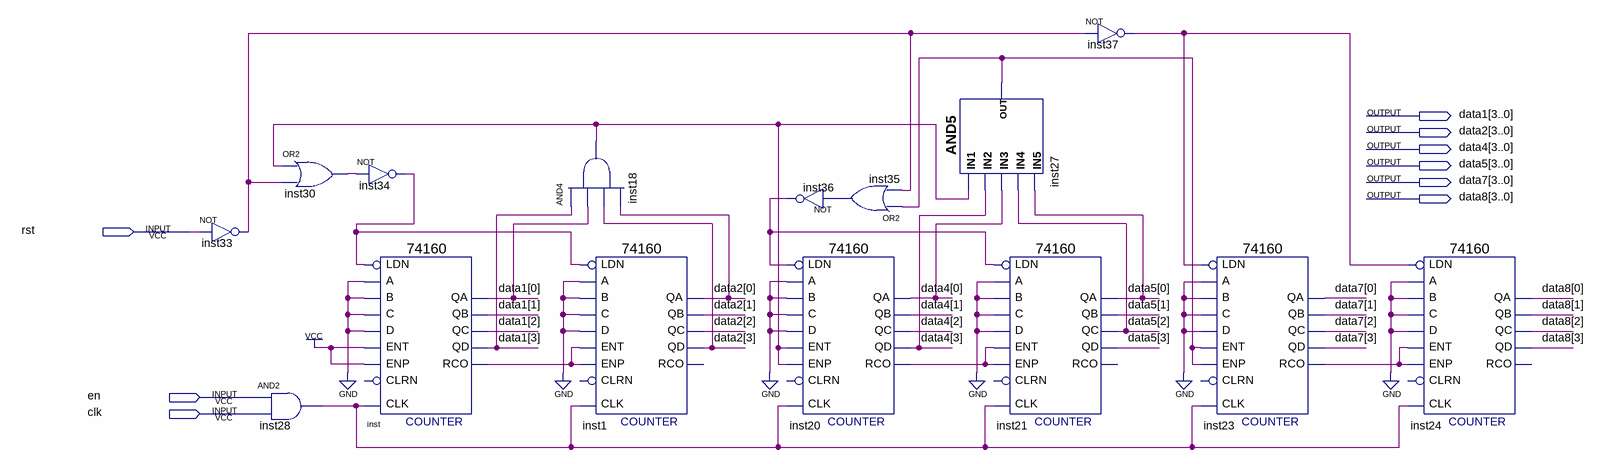
[diagram p0: schematic sheet]
// Quartus schematic timer.bdf as structural Verilog: 15 symbols, 9 pins
module timer (
  input  rst,
  input  en,
  input  clk,
  output [3:0] data1,
  output [3:0] data2,
  output [3:0] data4,
  output [3:0] data5,
  output [3:0] data7,
  output [3:0] data8
);

  wire inst18_out, inst20_rco, inst23_rco, inst27_out, inst28_out, inst30_out, inst33_out, inst34_out,
       inst35_out, inst36_out, inst37_out, inst_rco;

  not inst33 (inst33_out, rst);
  or inst30 (inst30_out, inst18_out, inst33_out);
  and inst28 (inst28_out, en, clk);
  not inst34 (inst34_out, inst30_out);
  \74160  inst (
    .CLK(inst28_out), .ENT(1'b1), .A(1'b0), .B(1'b0), .C(1'b0), .D(1'b0), .LDN(inst34_out), .ENP(1'b1),
    .QD(data1[3]), .QA(data1[0]), .QB(data1[1]), .QC(data1[2]), .RCO(inst_rco));  // open: CLRN
  and inst18 (inst18_out, data1[3], data1[0], data2[3], data2[0]);
  \74160  inst1 (
    .CLK(inst28_out), .ENT(inst_rco), .A(1'b0), .B(1'b0), .C(1'b0), .D(1'b0), .LDN(inst34_out),
    .ENP(inst_rco), .QD(data2[3]), .QA(data2[0]), .QB(data2[1]), .QC(data2[2]));  // open: CLRN, RCO
  not inst36 (inst36_out, inst35_out);
  \74160  inst20 (
    .CLK(inst28_out), .ENT(inst18_out), .A(1'b0), .B(1'b0), .C(1'b0), .D(1'b0), .LDN(inst36_out),
    .ENP(inst18_out), .QD(data4[3]), .QA(data4[0]), .QB(data4[1]), .QC(data4[2]), .RCO(inst20_rco));  // open: CLRN
  or inst35 (inst35_out, inst27_out, inst33_out);
  and inst27 (inst27_out, inst18_out, data4[3], data4[0], data5[2], data5[0]);
  \74160  inst21 (
    .CLK(inst28_out), .ENT(inst20_rco), .A(1'b0), .B(1'b0), .C(1'b0), .D(1'b0), .LDN(inst36_out),
    .ENP(inst20_rco), .QD(data5[3]), .QA(data5[0]), .QB(data5[1]), .QC(data5[2]));  // open: CLRN, RCO
  not inst37 (inst37_out, inst33_out);
  \74160  inst23 (
    .CLK(inst28_out), .ENT(inst27_out), .A(1'b0), .B(1'b0), .C(1'b0), .D(1'b0), .LDN(inst37_out),
    .ENP(inst27_out), .QD(data7[3]), .QA(data7[0]), .QB(data7[1]), .QC(data7[2]), .RCO(inst23_rco));  // open: CLRN
  \74160  inst24 (
    .CLK(inst28_out), .ENT(inst23_rco), .A(1'b0), .B(1'b0), .C(1'b0), .D(1'b0), .LDN(inst37_out),
    .ENP(inst23_rco), .QD(data8[3]), .QA(data8[0]), .QB(data8[1]), .QC(data8[2]));  // open: CLRN, RCO
endmodule
